# EAGLE design shinobi_expand (EAGLE 8.2.2)
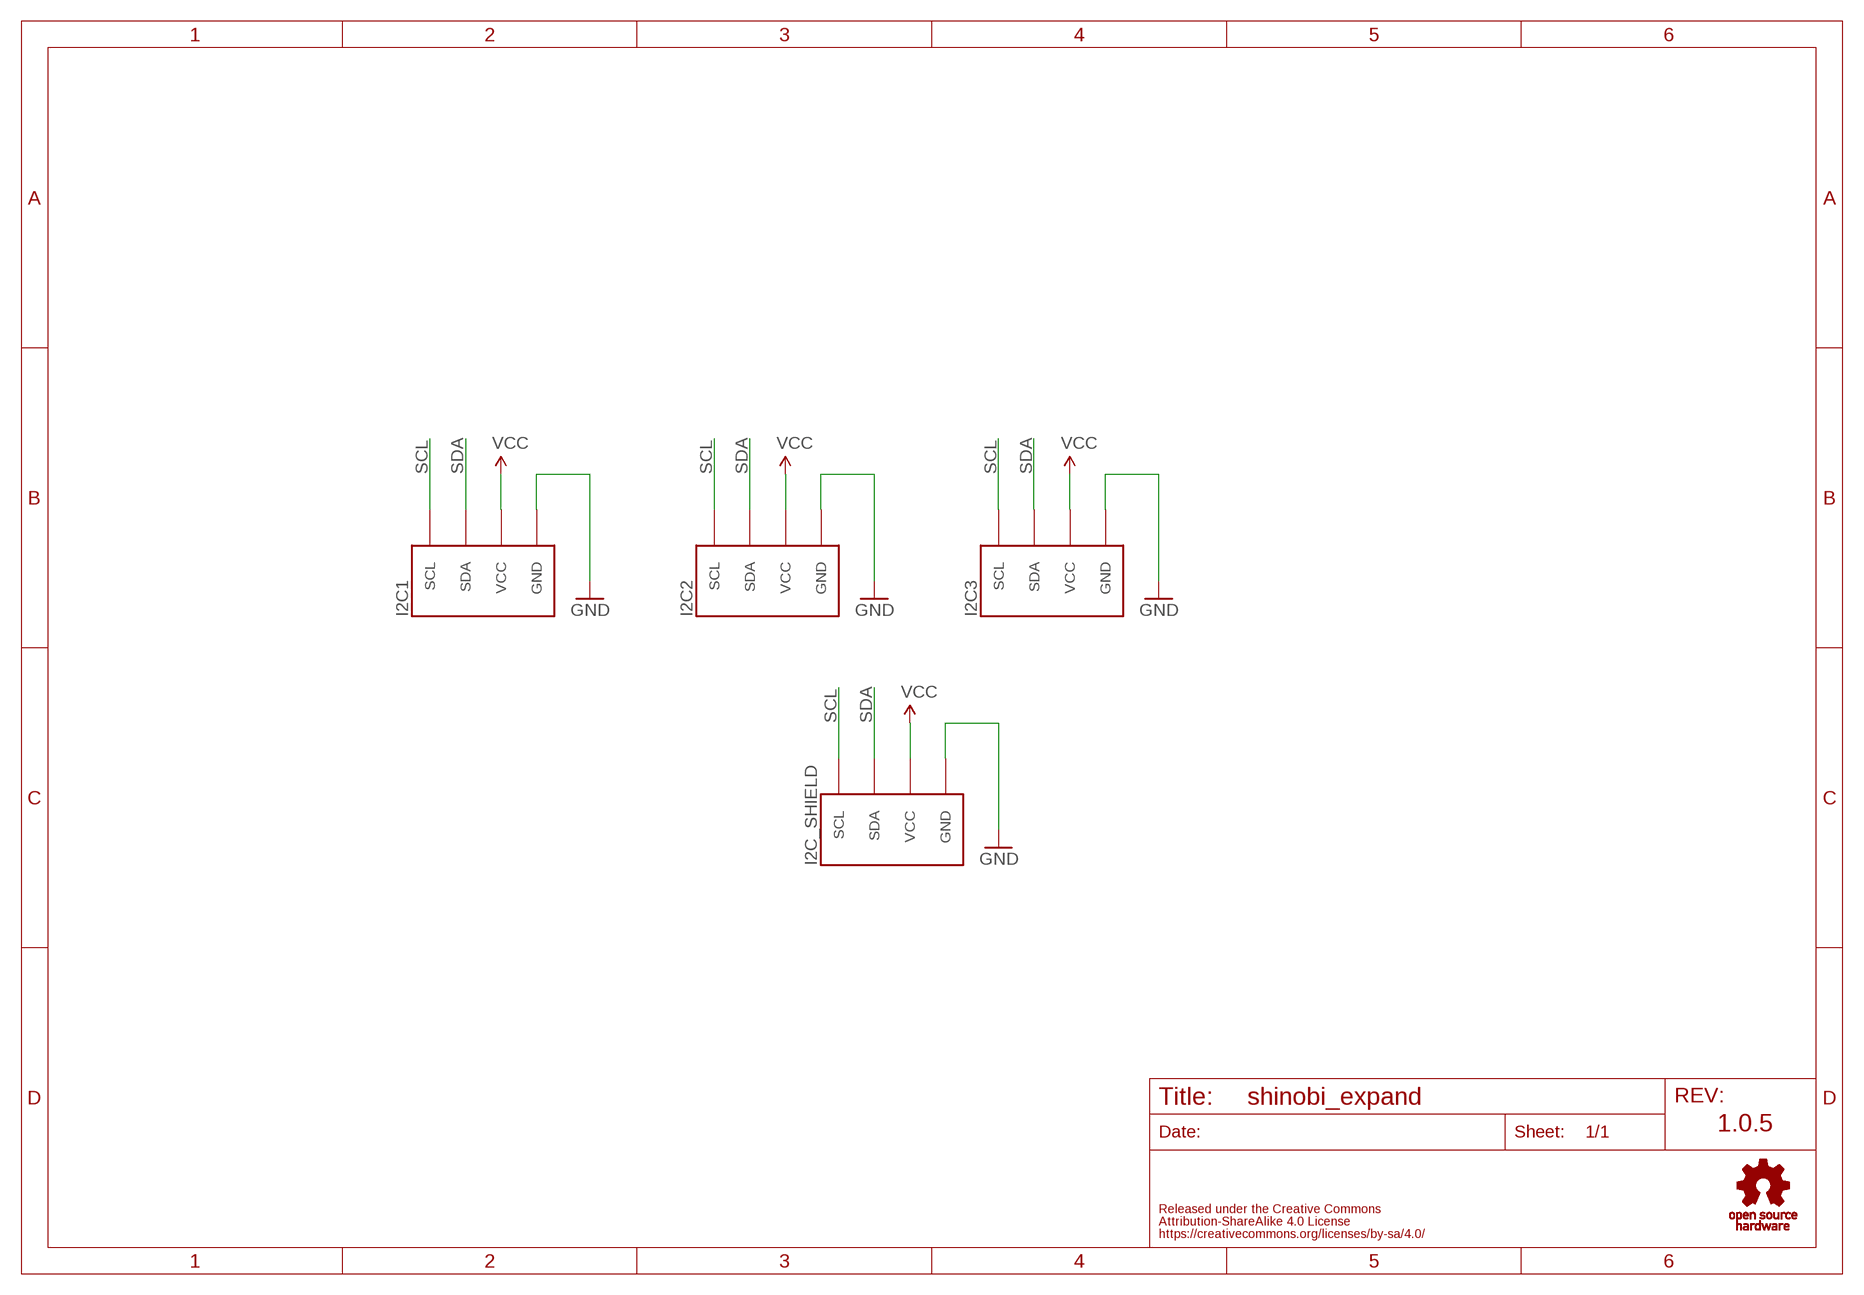
[diagram p0: schematic, sheet 1]

## Parts
I2C1  FABO_BRICK_I2C-S04B-PASK-2_LONG  [FABO_BRICK_I2C_S04B-PASK-2_LONG]
I2C2  FABO_BRICK_I2C-S04B-PASK-2_LONG  [FABO_BRICK_I2C_S04B-PASK-2_LONG]
I2C3  FABO_BRICK_I2C-S04B-PASK-2_LONG  [FABO_BRICK_I2C_S04B-PASK-2_LONG]
I2C_SHIELD  FABO_BRICK_I2C-S04B-PASK-2_LONG  [FABO_BRICK_I2C_S04B-PASK-2_LONG]
U$11  LOGO_OSHW-M_BOTTOM  [LOGO_OSHW_M_BOTTOM]

## Nets
GND: I2C1.GND I2C2.GND I2C3.GND I2C_SHIELD.GND
SCL: I2C1.SCL I2C2.SCL I2C3.SCL I2C_SHIELD.SCL
SDA: I2C1.SDA I2C2.SDA I2C3.SDA I2C_SHIELD.SDA
VCC: I2C1.VCC I2C2.VCC I2C3.VCC I2C_SHIELD.VCC

## Notes on the sheet
- 1.0.5

## Library data of the parts
I2C1-I2C3 I2C_SHIELD = FaBo-Template:FABO_BRICK_I2C: FaBo Brick I2C
U$11 = FaBo-etc:LOGO_OSHW

## Board
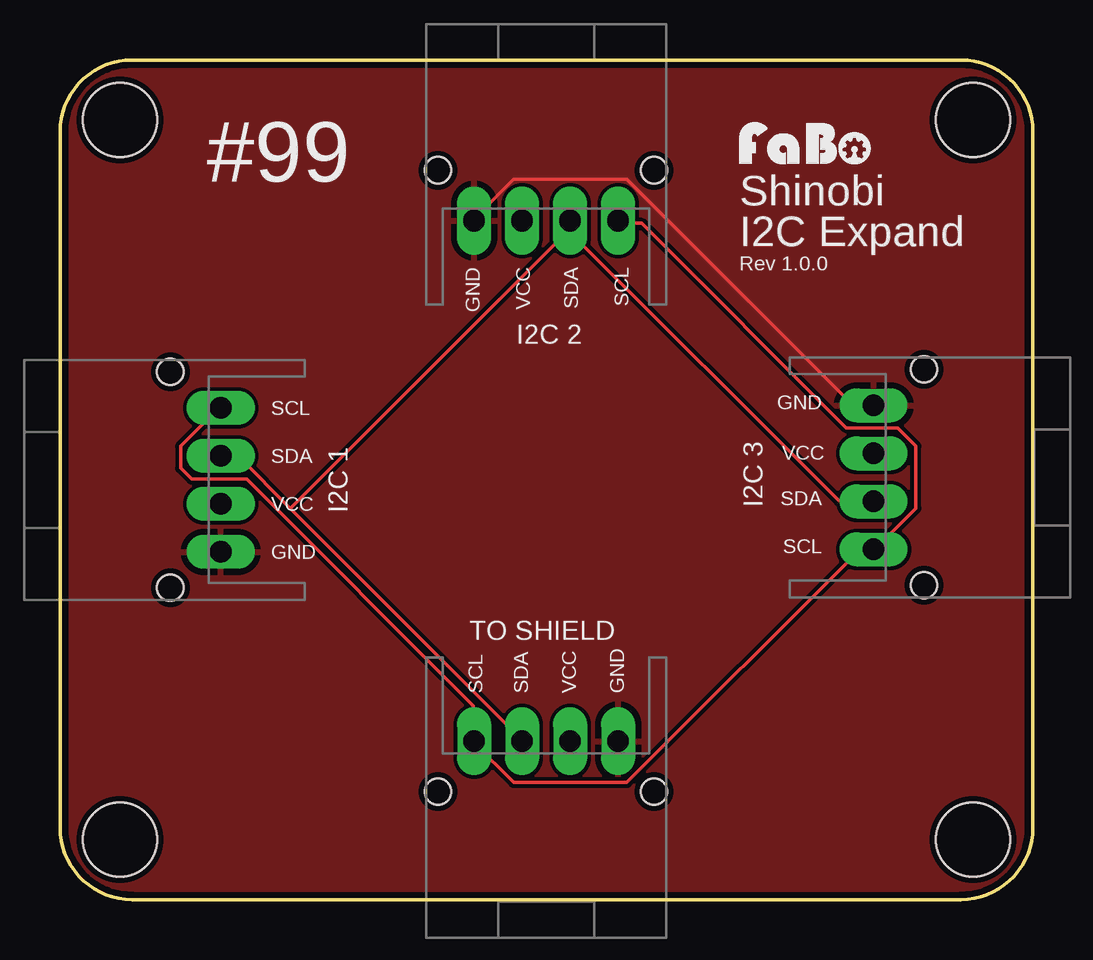
[diagram p1: board, top side]
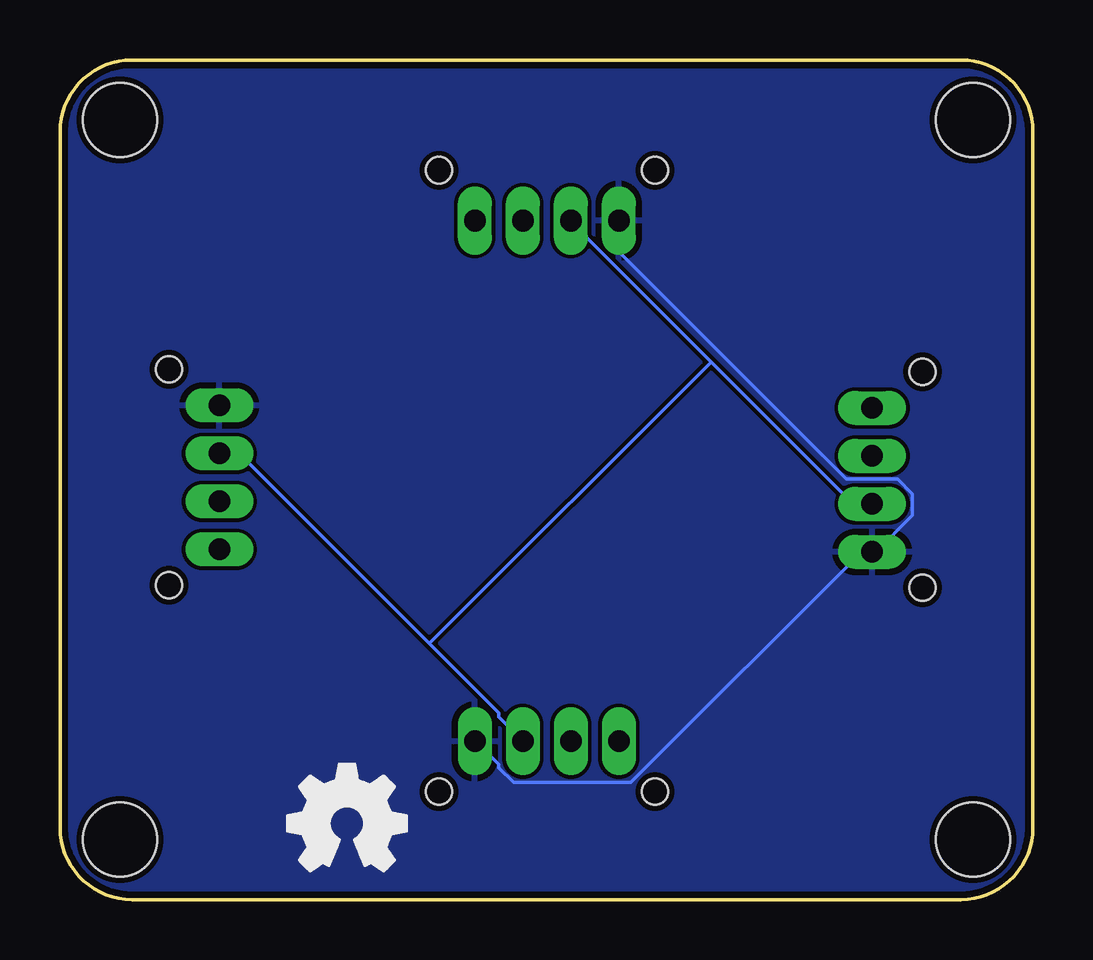
[diagram p2: board, bottom side, seen from below]

Size 40.54 x 35 mm. Coordinates in mm from the lower left corner, seen from the top.
Copper layers (1*16): Top 0.035mm / dielectric 1.5mm / Bottom 0.035mm
Design rules "SeeedStudio_2layer_DRU_no_angle_20140221": minimum track width 6mil, minimum drill 12mil, track to track 6mil, track to pad 6mil, pad to pad 6mil, via to via 6mil, smd to smd 0mil, copper to edge 10mil, drill to drill 10mil, minimum pad ring 10mil, minimum via ring 6mil, stop-mask expansion 2mil, vias tented up to drill 100mil, thermal gap 10mil

### Footprints (pad centres in the part's own frame; a part is rotated, then mirrored left to right if it is on the bottom)
FABO_BRICK_I2C_S04B-PASK-2_LONG = drill 0.9 pad 1.422 long: GND -3,0; SCL 3,0; SDA 1,0; VCC -1,0 | hole 1.1: 4.5,2.1; -4.5,2.1
FABO-SHINOBI = hole 3.1: 2.5,32.5; 38.04,32.5; 38.04,2.5; 2.5,2.5

### Placement (x,y rotation side)
I2C1  20.25,28.3 0 top
I2C2  33.9,17.6 270 top
I2C3  6.7,17.5 90 top
I2C_SHIELD  20.25,6.6 180 top
U$2  [FABO-SHINOBI]  0,0 0 top
U$3  [LOGO_FABO_S]  31.1,30.5 0 top
U$11  28.57,3.17 0 top

### Tracks (layer width: path | path; a pad name or v marks a point on that pad's centre or on a via)
GND
  Top 0.152: I2C2.GND 33.83,20.73 32.92,20.73 23.62,30.02 18.9,30.02 17.22,28.35 I2C1.GND
  Bottom 0.152: I2C_SHIELD.GND 23.16,6.55 22.25,5.64 22.25,5.49 21.64,4.88 16.76,4.88 7.16,14.48 6.71,14.48 I2C3.GND 6.55,14.48 5.03,16 5.03,16.92 5.64,17.53 7.77,17.53 17.22,26.98 17.22,28.19 I2C1.GND
  pour Bottom: 0,0 41,0 41,35 0,35
  pour Top: 0,0 41,0 41,35 0,35
SCL
  Top 0.152: I2C3.SCL 6.55,20.42 5.03,18.9 5.03,17.98 5.49,17.53 7.77,17.53 17.22,8.08 17.22,6.71 I2C_SHIELD.SCL 17.22,6.55 18.9,4.88 23.62,4.88 33.22,14.48 33.83,14.48 I2C2.SCL 33.98,14.63 35.66,16.31 35.66,18.9 34.9,19.66 32.77,19.66 24.23,28.19 23.32,28.19 I2C1.SCL
SDA
  Top 0.152: 9.6,16.31 7.47,18.44 6.71,18.44 I2C3.SDA | 9.6,16.31 19.2,6.71 I2C_SHIELD.SDA | 21.18,27.89 21.18,28.19 I2C1.SDA 21.18,27.89 | 9.6,16.31 21.18,27.89 | 21.18,27.89 32.46,16.61 33.83,16.61 I2C2.SDA
VCC
  Bottom 0.152: 13.41,22.4 19.2,28.19 I2C1.VCC | 13.41,22.4 7.62,16.61 6.71,16.61 I2C3.VCC | 25.15,10.67 33.07,18.59 33.83,18.59 I2C2.VCC | 25.15,10.67 22.25,7.77 22.25,7.62 21.34,6.71 I2C_SHIELD.VCC | 25.15,10.67 13.41,22.4

### Text on the board
tPlace: #99 | Shinobi | I2C Expand | GND | VCC | SDA | SCL | Rev 1.0.0 | I2C 2 | GND | SCL | VCC | SDA | I2C 1 | I2C 3 | SDA | VCC | SCL | GND | TO SHIELD | SCL | SDA | VCC | GND